# EAGLE design Power-Switch-Board-v1 (EAGLE 9.6.2)
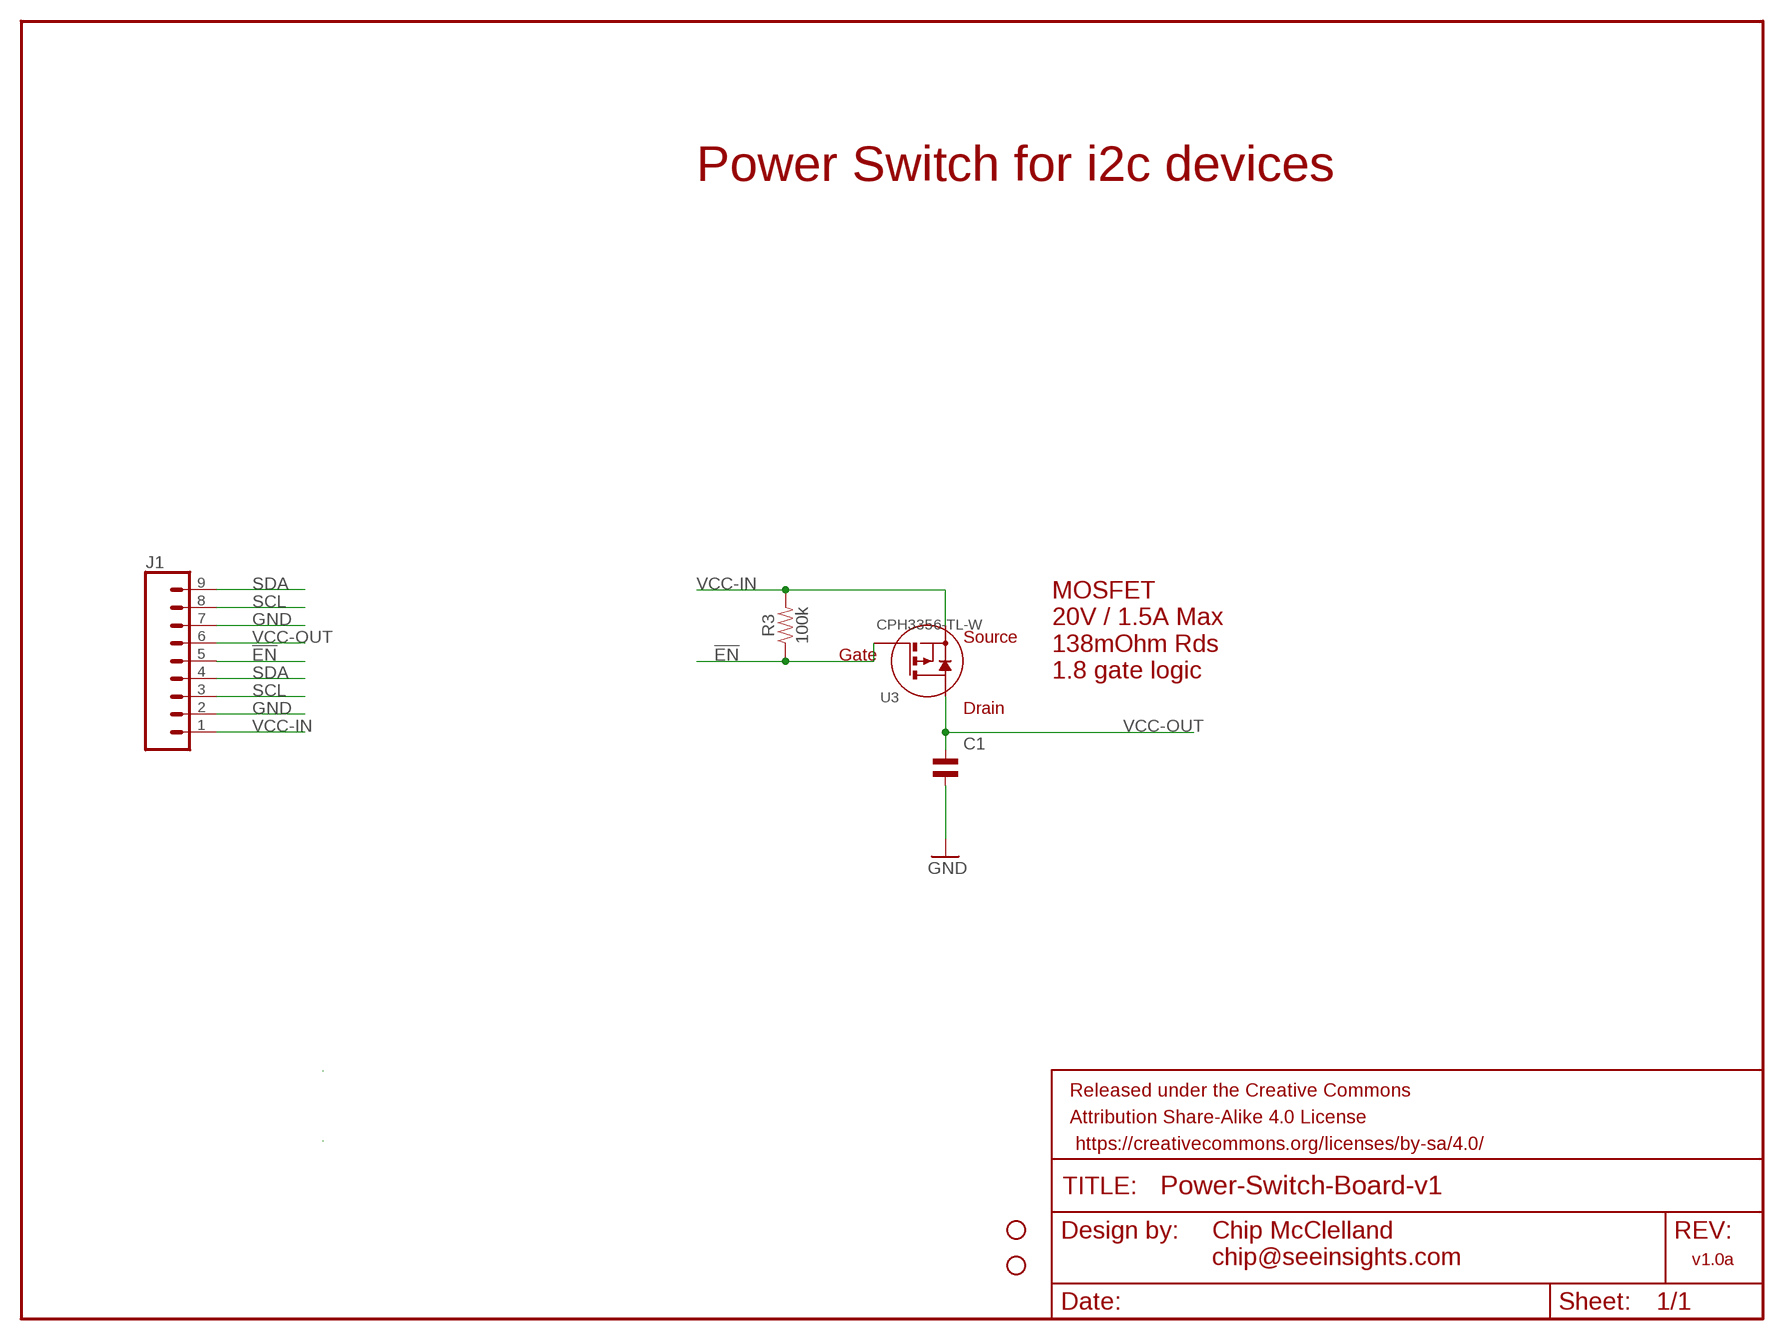
[diagram p0: schematic, sheet 1]

## Parts
C1  CAP-MF-0.1UF-  [C0805]
FRAME1  FRAME-LETTER  [CREATIVE_COMMONS]
H1  STAND-OFF-M2.5  [STAND-OFF-M2.5]
H2  STAND-OFF-M2.5  [STAND-OFF-M2.5]
J1  CONN_09  [1X09]
R3  100k  RESISTOR-MF-100K-0805  [0805]
U3  CPH3356-TL-W  [SOT-23_ONS]

## Nets
!EN: J1.5 R3.1 U3.1(GATE)
GND: C1.P$2 J1.2 J1.7
SCL: J1.3 J1.8
SDA: J1.4 J1.9
VCC-IN: J1.1 R3.2 U3.2(SOURCE)
VCC-OUT: C1.P$1 J1.6 U3.3(DRAIN)

## Notes on the sheet
- Power Switch for i2c devices
- MOSFET
  20V / 1.5A Max
  138mOhm Rds
  1.8 gate logic
- Chip McClelland
  chip@seeinsights.com
- v1.0a

## Library data of the parts
C1 = Custom Components:CAP-MF-0.1UF-: Capacitor Macrofab House Part (https://factory.macrofab.com/parts). Standard ceramic capacitor, and 0.1" leaded capacitor.; DIELECTRIC: Y5V; HOUSEPART: YES; MPN: MF-CAP-0805-0.1uF; POPULATE: 1; VOLTAGE: 50V
FRAME1 = SparkFun-Aesthetics:FRAME-LETTER: Schematic Frame - Letter Standard 8.5x11 US Letter frame
H1 H2 = Custom Components:STAND-OFF-M2.5: Stand Off Drill holes for mechanically mounting via screws, standoffs, etc. Note: Use the keepout ring to avoid running the screw head into surrounding components. Variant Overviews STAND-OFF - Mechanical footprint for a M2.5 phillips button head screw. STAND-OFF-TIGHT - Mechanical footprint for a M2.5 phillips button head screw, Example SparkFun Products
J1 = SparkFun-Connectors:CONN_09: Multi connection point. Often used as Generic Header-pin footprint for 0.1 inch spaced/style header connections On any of the 0.1 inch spaced packages, you can populate with these: Break Away Headers - Straight <https://www.sparkfun.com/products/116> (PRT-00116) Break Away Male Headers - Right Angle <https://www.sparkfun.com/products/553> (PRT-00553) Female Headers <https://www.sparkfun.com/products/115> (PRT-00115) Break Away Headers - Machine Pin <https://www.sparkfun.com/products/117> (PRT-00117) Break Away Female Headers - Swiss Machine Pin <https://www.sparkfun.com/products/743> (PRT-00743) For SCREWTERMINALS and SPRING TERMINALS visit here: Screw Terimnals on SparkFun.com <https://www.sparkfun.com/search/results?term=Screw+Terminals> (5mm/3.5mm/2.54mm spacing) This device is also useful as a general connection point to wire up your design to another part of your project. Our various solder wires solder well into these plated through hole pads. Hook-Up Wire - Assortment (Stranded, 22 AWG) <https://www.sparkfun.com/products/11375> (PRT-11375) Hook-Up Wire - Assortment (Solid Core, 22 AWG) <https://www.sparkfun.com/products/11367> (PRT-11367) View the entire wire category on our website here <https://www.sparkfun.com/categories/141> Special notes: Molex polarized connector foot print use with SKU : PRT-08231 with associated crimp pins and housings. 1MM SMD Version SKU: PRT-10208 NOTES ON THE VARIANTS LOCK and LOCK_LONGPADS... This footprint was designed to help hold the alignment of a through-hole component (i.e. 6-pin header) while soldering it into place. You may notice that each hole has been shifted either up or down by 0.005 of an inch from it's more standard position (which is a perfectly straight line). This slight alteration caused the pins (the squares in the middle) to touch the edges of the holes. Because they are alternating, it causes a "brace" to hold the component in place. 0.005 has proven to be the perfect amount of "off-center" position when using our standard breakaway headers. Although looks a little odd when you look at the bare footprint, once you have a header in there, the alteration is very hard to notice. Also,if you push a header all the way into place, it is covered up entirely on the bottom side.
R3 = Custom Components:RESISTOR-MF-100K-: Generic 0805 Resistor Package; MPN: MF-RES-0805-100K; POPULATE: 1; URL: https://factory.macrofab.com/part/MF-RES-0805-100K
U3 = Custom Components:CPH3356-TL-W; COPYRIGHT: Copyright (C) 2021 Ultra Librarian. All rights reserved.; DIGI-KEY_PART_NUMBER_1: CPH3356-TL-WOSTR-ND; DIGI-KEY_PART_NUMBER_2: CPH3356-TL-WOSCT-ND; DIGI-KEY_PART_NUMBER_3: CPH3356-TL-WOSDKR-ND; MANUFACTURER_PART_NUMBER: CPH3356-TL-W; MFR_NAME: onsemi

## Board
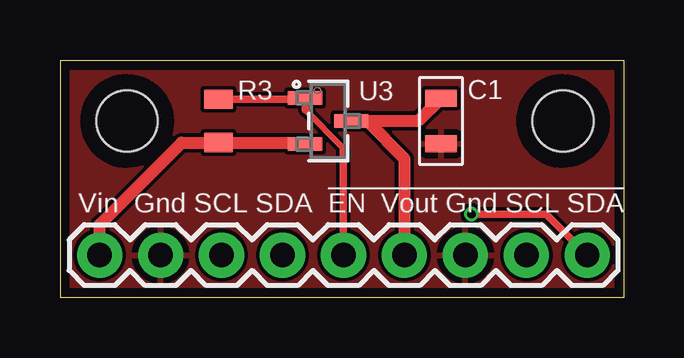
[diagram p1: board, top side]
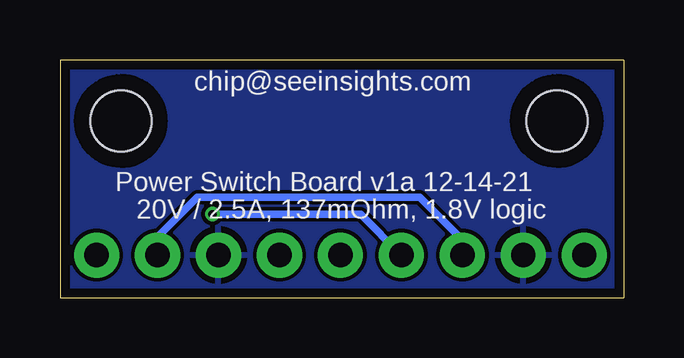
[diagram p2: board, bottom side, seen from below]

Size 23.5 x 9.91 mm. Coordinates in mm from the lower left corner, seen from the top.
Outline: 0,9.91 23.5,9.91 23.5,0 0,0 0,9.91
Copper layers (1*16): Top 0.035559375mm / dielectric 1.6mm / Bottom 0.035559375mm
Design rules "oshpark-2layer": minimum track width 6mil, minimum drill 10mil, track to track 6mil, track to pad 6mil, pad to pad 6mil, via to via 6mil, smd to smd 6mil, copper to edge 15mil, drill to drill 6mil, minimum pad ring 5mil, minimum via ring 5mil, stop-mask expansion 2.5mil, vias tented up to drill 0mil, thermal gap 10mil

### Footprints (pad centres in the part's own frame; a part is rotated, then mirrored left to right if it is on the bottom)
C0805 = smd 0.7 x 1.3: P$1 -0.95,0; P$2 0.95,0
STAND-OFF-M2.5 = hole 2.54: 0,0
1X09 = drill 1.016 pad 1.88: 1 0,0; 2 2.54,0; 3 5.08,0; 4 7.62,0; 5 10.16,0; 6 12.7,0; 7 15.24,0; 8 17.78,0; 9 20.32,0
0805 = smd 0.8 x 1.2: 1 -0.9,0; 2 0.9,0
SOT-23_ONS = smd 0.559 x 1.422: 1 -0.953,-0.965; 2 0.953,-0.965; 3 0,0.965

### Placement (x,y rotation side)
C1  15.88,7.37 270 top
FRAME1  16.51,-12.7 0 top  (outside the outline)
H1  20.95,7.37 0 top
H2  2.79,7.37 0 top
J1  1.65,1.78 0 top
R3  6.6,7.37 270 top
U3  11.18,7.37 270 top

### Tracks (layer width: path | path; a pad name or v marks a point on that pad's centre or on a via)
!EN
  Top 0.254: 11.81,6.22 10.21,7.82
  Top 0.305: R3.1 10.16,8.27 U3.1 10.21,7.82 | 11.81,6.22 J1.5
GND
  pour Top: -1.27,26.67 57.66,26.67 57.66,-1.27 -1.27,-1.27
  pour Bottom: -1.27,26.67 59.44,26.67 59.44,-1.27 -1.27,-1.27
SCL
  Bottom 0.305: J1.3 6.73,2.41 8.51,4.19 17.78,4.19 19.43,2.54 J1.8
SDA  (via drill 0.35)
  Top 0.305: v17.14,3.48 20.27,3.48 J1.9
  Bottom 0.305: J1.4 10.97,3.48 v17.14,3.48
VCC-IN
  Top 0.508: J1.1 1.65,3.05 5.07,6.47 R3.2 10.16,6.47 U3.2
VCC-OUT
  Top 0.508: J1.6 14.35,5.79 12.78,7.37 U3.3 14.93,7.37 C1.P$1

### Text on the board
tNames: Vin Gnd SCL SDA !EN Vout Gnd SCL SDA
bNames: chip@seeinsights.com | Power Switch Board v1a 12-14-21 | 20V / 2.5A, 137mOhm, 1.8V logic